# Altium project fmu-io.PrjPcb
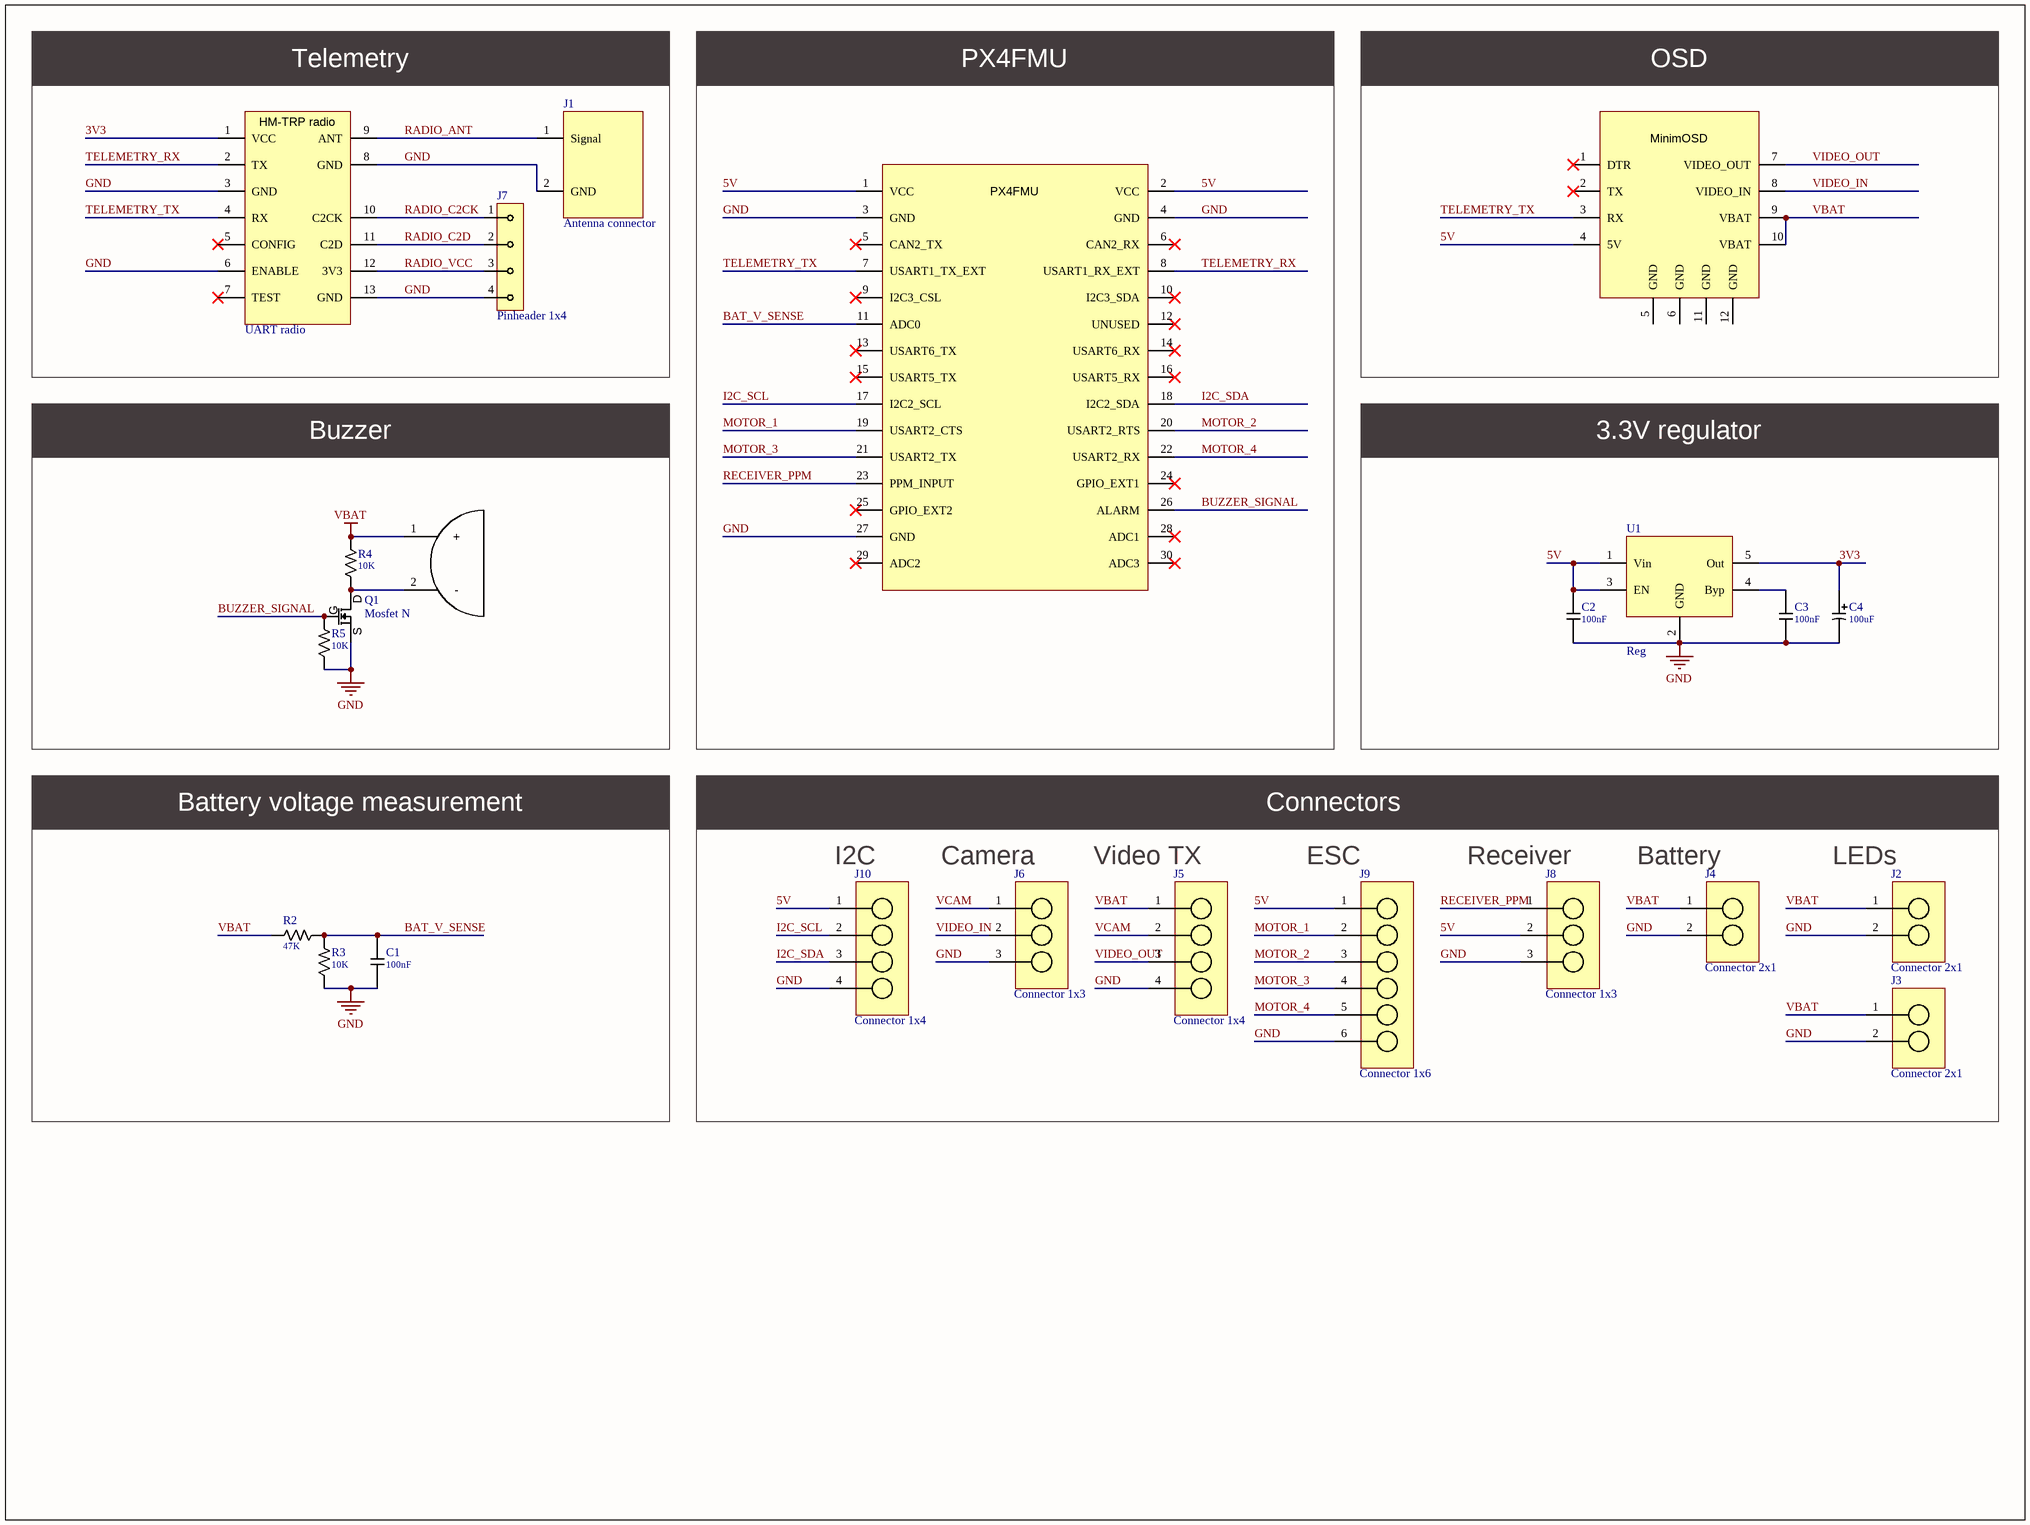
[diagram p0: fmu-io.SchDoc]
1 sheet, 24 parts. Net scope: global (net labels, ports and power ports of the same name join across sheets).
Board file: fmu-io.PcbDoc

## Sheet fmu-io.SchDoc
size 379 x 284 mm

### Parts
C1  value 100nF  [CAP-0603-GEN]  (hidden comment: CAPACITOR)
C2  value 100nF  [CAP-0603-GEN]  (hidden comment: CAPACITOR)
C3  value 100nF  [CAP-0603-GEN]  (hidden comment: CAPACITOR)
C4  value 100uF  [CAP-1206-POL]  (hidden comment: CAPACITOR-POLARIZED)
J1  Antenna connector  [ANTENNA-CONNECTOR]
J2  Connector 2x1  [DF13-2H-SMD]
J3  Connector 2x1  [DF13-2H-SMD]
J4  Connector 2x1  [JST-PA-2H-SMD]
J5  Connector 1x4  [DF13-4H-SMD]
J6  Connector 1x3  [DF13-3H-SMD]
J7  Pinheader 1x4  [PINHEADER-1x4-right-angle]
J8  Connector 1x3  [DF13-3H-SMD]
J9  Connector 1x6  [DF13-6H-SMD]
J10  Connector 1x4  [DF13-4H-SMD]
OSD  OSD  [MINIMOSD]  (value not drawn)
PX4FMU  PX4FMU  [HEADER-2x15-SMD]  (value not drawn)
Q1  Mosfet N  [SOT23-3]
R1  UART radio  [HM-TRP]
R2  value 47K  [RESISTOR-0603]  (hidden comment: RESISTOR)
R3  value 10K  [RESISTOR-0603]  (hidden comment: RESISTOR)
R4  value 10K  [RESISTOR-0603]  (hidden comment: RESISTOR)
R5  value 10K  [RESISTOR-0603]  (hidden comment: RESISTOR)
SG1  Buzzer  [BUZZER-ABI-017-RC]  (value not drawn)
U1  Reg  [SOT23-5]

### Blocks framed on the sheet
Telemetry: J1 J7 R1
PX4FMU: PX4FMU
OSD: OSD
Buzzer: Q1 R4 R5 SG1
3.3V regulator: C2-C4 U1
Battery voltage measurement: C1 R2 R3

### Nets
GND: C1.1 C2.1 C3.1 C4.2 J1.2(GND) J2.2 J3.2 J4.2 J5.4 J6.3 J7.4 J8.3 J9.6 J10.4 PX4FMU.3(GND) PX4FMU.4(GND) PX4FMU.27(GND) Q1.2(Source) R1.3(GND) R1.6(ENABLE) R1.8(GND) R1.13(GND) R3.1 R5.1 U1.2(GND)
VBAT: J2.1 J3.1 J4.1 J5.1 OSD.9(VBAT) OSD.10(VBAT) R2.1 R4.2 SG1.1(+)
3V3: C4.1 R1.1(VCC) U1.5(Out)
5V: C2.2 J8.2 J9.1 J10.1 OSD.4(5V) PX4FMU.1(VCC) PX4FMU.2(VCC) U1.1(Vin) U1.3(EN)
BAT_V_SENSE: C1.2 PX4FMU.11(ADC0) R2.2 R3.2
BUZZER_SIGNAL: PX4FMU.26(ALARM) Q1.1(Gate) R5.2
I2C_SCL: J10.2 PX4FMU.17(I2C2_SCL)
I2C_SDA: J10.3 PX4FMU.18(I2C2_SDA)
MOTOR_1: J9.2 PX4FMU.19(USART2_CTS)
MOTOR_2: J9.3 PX4FMU.20(USART2_RTS)
MOTOR_3: J9.4 PX4FMU.21(USART2_TX)
MOTOR_4: J9.5 PX4FMU.22(USART2_RX)
RADIO_ANT: J1.1(Signal) R1.9(ANT)
RADIO_C2CK: J7.1 R1.10(C2CK)
RADIO_C2D: J7.2 R1.11(C2D)
RADIO_VCC: J7.3 R1.12(3V3)
RECEIVER_PPM: J8.1 PX4FMU.23(PPM_INPUT)
TELEMETRY_RX: PX4FMU.8(USART1_RX_EXT) R1.2(TX)
TELEMETRY_TX: OSD.3(RX) PX4FMU.7(USART1_TX_EXT) R1.4(RX)
VCAM: J5.2 J6.1
VIDEO_IN: J6.2 OSD.8(VIDEO_IN)
VIDEO_OUT: J5.3 OSD.7(VIDEO_OUT)
NetC3_2: C3.2 U1.4(Byp)
NetQ1_3: Q1.3(Drain) R4.1 SG1.2(-)

Not connected (* = marked no-connect by the designer): OSD 1(DTR)* 2(TX)* 5(GND) 6(GND) 11(GND) 12(GND); PX4FMU 5(CAN2_TX)* 6(CAN2_RX)* 9(I2C3_CSL)* 10(I2C3_SDA)* 12(UNUSED)* 13(USART6_TX)* 14(USART6_RX)* 15(USART5_TX)* 16(USART5_RX)* 24(GPIO_EXT1)* 25(GPIO_EXT2)* 28(ADC1)* 29(ADC2)* 30(ADC3)*; R1 5(CONFIG)* 7(TEST)*

### Notes on the sheet
- Connectors
- (near J10) I2C
- (near J6) Camera
- (near J5) Video TX
- (near J9) ESC
- (near J8) Receiver
- (near J4) Battery
- (near J2) LEDs
- (in symbol HM-TRP) HM-TRP radio
- (in symbol MINIMOSD) MinimOSD
- (in symbol MOSFET-N) D; G; S

### Library data of the parts
C4 = CAPACITOR-POLARIZED: Polarized capacitor
J1 = ANTENNA-CONNECTOR
J2-J4 = CONNECTOR-1x2: Single row two contact connector
J5 J10 = CONNECTOR-1x4: Single row 4 contact connector
J6 J8 = CONNECTOR-1x3: Single row 3 contact connector
J7 = PINHEADER-1x4: Single row four pin header
J9 = CONNECTOR-1x6: Single row 6 contact connector
OSD = MINIMOSD: On-screen display
PX4FMU = PX4FMU: PX4FMU flight controller
Q1 = MOSFET-N: N-channel mosfet
R1 = HM-TRP: UART long range radio
U1 = SOT23-REG: Voltage regulator